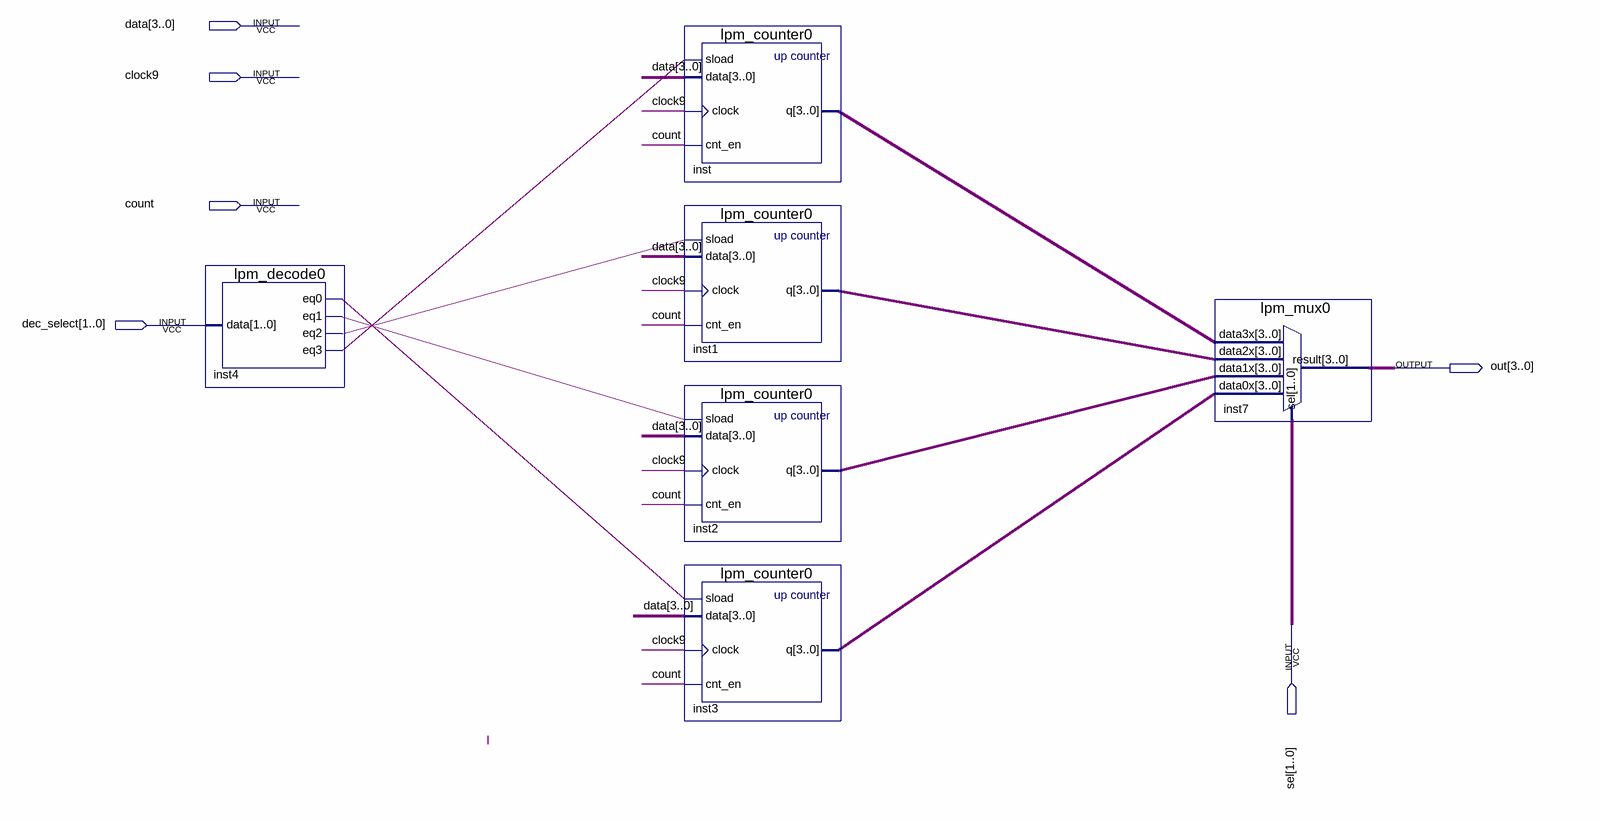
[diagram p0: schematic sheet]
// Quartus schematic 2012510017.bdf as structural Verilog: 6 symbols, 6 pins
module \2012510017  (
  input  [3:0] data,
  input  clock9,
  input  count,
  input  [1:0] dec_select,
  input  [1:0] sel,
  output [3:0] out
);

  wire inst4_eq0, inst4_eq1, inst4_eq2, inst4_eq3;
  wire [3:0] inst1_q, inst2_q, inst3_q, inst_q;

  lpm_decode0 inst4 (.data(dec_select), .eq0(inst4_eq0), .eq1(inst4_eq1), .eq2(inst4_eq2), .eq3(inst4_eq3));
  lpm_counter0 inst (.sload(inst4_eq3), .data(data), .clock(clock9), .cnt_en(count), .q(inst_q));
  lpm_counter0 inst1 (.sload(inst4_eq2), .data(data), .clock(clock9), .cnt_en(count), .q(inst1_q));
  lpm_counter0 inst2 (.sload(inst4_eq1), .data(data), .clock(clock9), .cnt_en(count), .q(inst2_q));
  lpm_counter0 inst3 (.sload(inst4_eq0), .data(data), .clock(clock9), .cnt_en(count), .q(inst3_q));
  lpm_mux0 inst7 (.data3x(inst_q), .data2x(inst1_q), .data1x(inst2_q), .data0x(inst3_q), .sel(sel), .result(out));
endmodule
